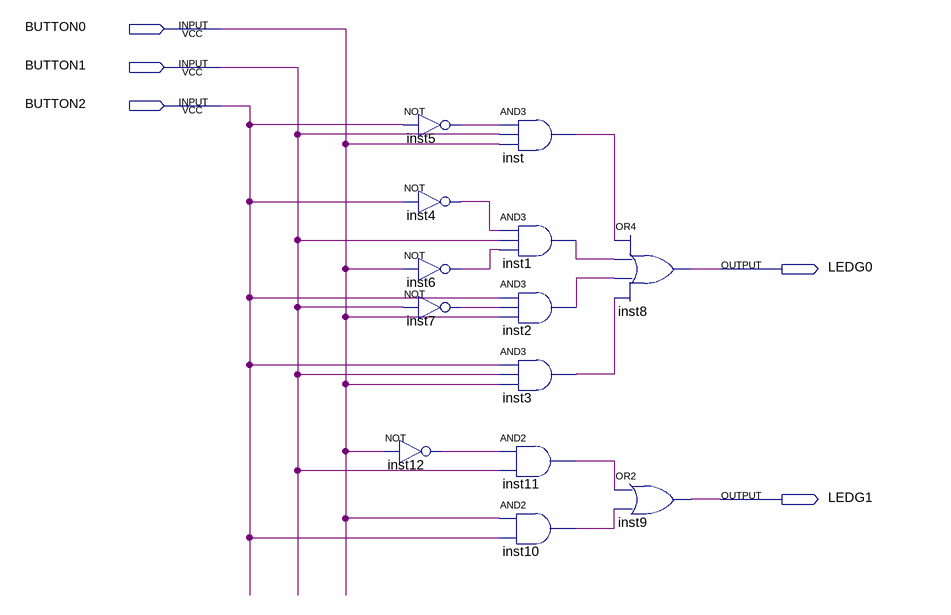
[diagram p0: schematic sheet]
// Quartus schematic lab3.bdf as structural Verilog: 13 symbols, 5 pins
module lab3 (
  input  BUTTON0,
  input  BUTTON1,
  input  BUTTON2,
  output LEDG0,
  output LEDG1
);

  wire inst1_out, inst2_out, inst3_out, inst4_out, inst5_out, inst6_out, inst7_out, inst10_out, inst11_out,
       inst12_out, inst_out;

  not inst5 (inst5_out, BUTTON2);
  not inst4 (inst4_out, BUTTON2);
  not inst6 (inst6_out, BUTTON0);
  not inst7 (inst7_out, BUTTON1);
  not inst12 (inst12_out, BUTTON0);
  and inst (inst_out, inst5_out, BUTTON1, BUTTON0);
  and inst1 (inst1_out, inst4_out, BUTTON1, inst6_out);
  and inst2 (inst2_out, BUTTON2, inst7_out, BUTTON0);
  and inst3 (inst3_out, BUTTON2, BUTTON1, BUTTON0);
  and inst11 (inst11_out, inst12_out, BUTTON1);
  and inst10 (inst10_out, BUTTON0, BUTTON2);
  or inst8 (LEDG0, inst_out, inst1_out, inst2_out, inst3_out);
  or inst9 (LEDG1, inst11_out, inst10_out);
endmodule
